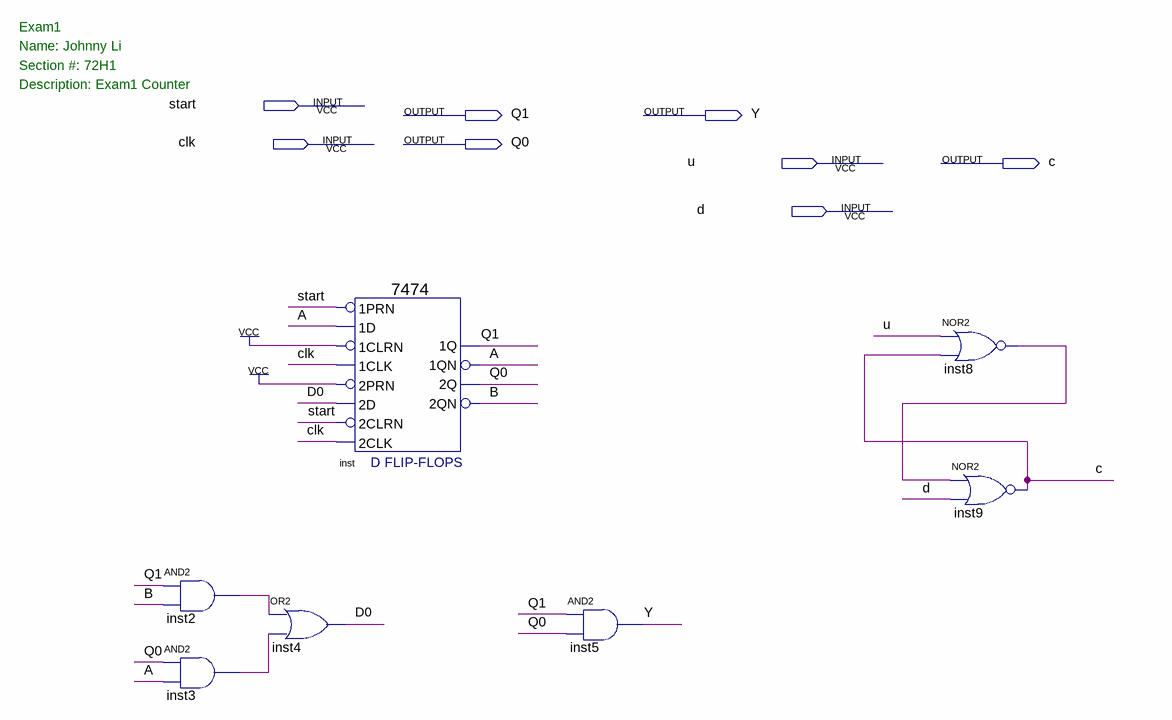
[diagram p0: schematic sheet]
// Quartus schematic Exam1.bdf as structural Verilog: 7 symbols, 8 pins
module Exam1 (
  input  start,
  input  clk,
  input  u,
  input  d,
  output Q1,
  output Y,
  output Q0,
  output c
);

  wire A, B, D0, inst2_out, inst3_out, inst8_out;

  and inst2 (inst2_out, Q1, B);
  and inst3 (inst3_out, Q0, A);
  or inst4 (D0, inst2_out, inst3_out);
  \7474  inst (
    .\2D (D0), .\2PRN (1'b1), .\1CLK (clk), .\1D (A), .\1PRN (start), .\2CLK (clk), .\2CLRN (start),
    .\1CLRN (1'b1), .\1QN (A), .\2Q (Q0), .\2QN (B), .\1Q (Q1));
  and inst5 (Y, Q1, Q0);
  nor inst8 (inst8_out, u, c);
  nor inst9 (c, inst8_out, d);

  // Notes on the sheet:
  //   Exam1
  //   Name: Johnny Li
  //   Section #: 72H1
  //   Description: Exam1 Counter
endmodule
